# Altium schematic sheet ADS1299IPAG.SchDoc
size A3; SheetNumber: 4; SheetTotal: 9
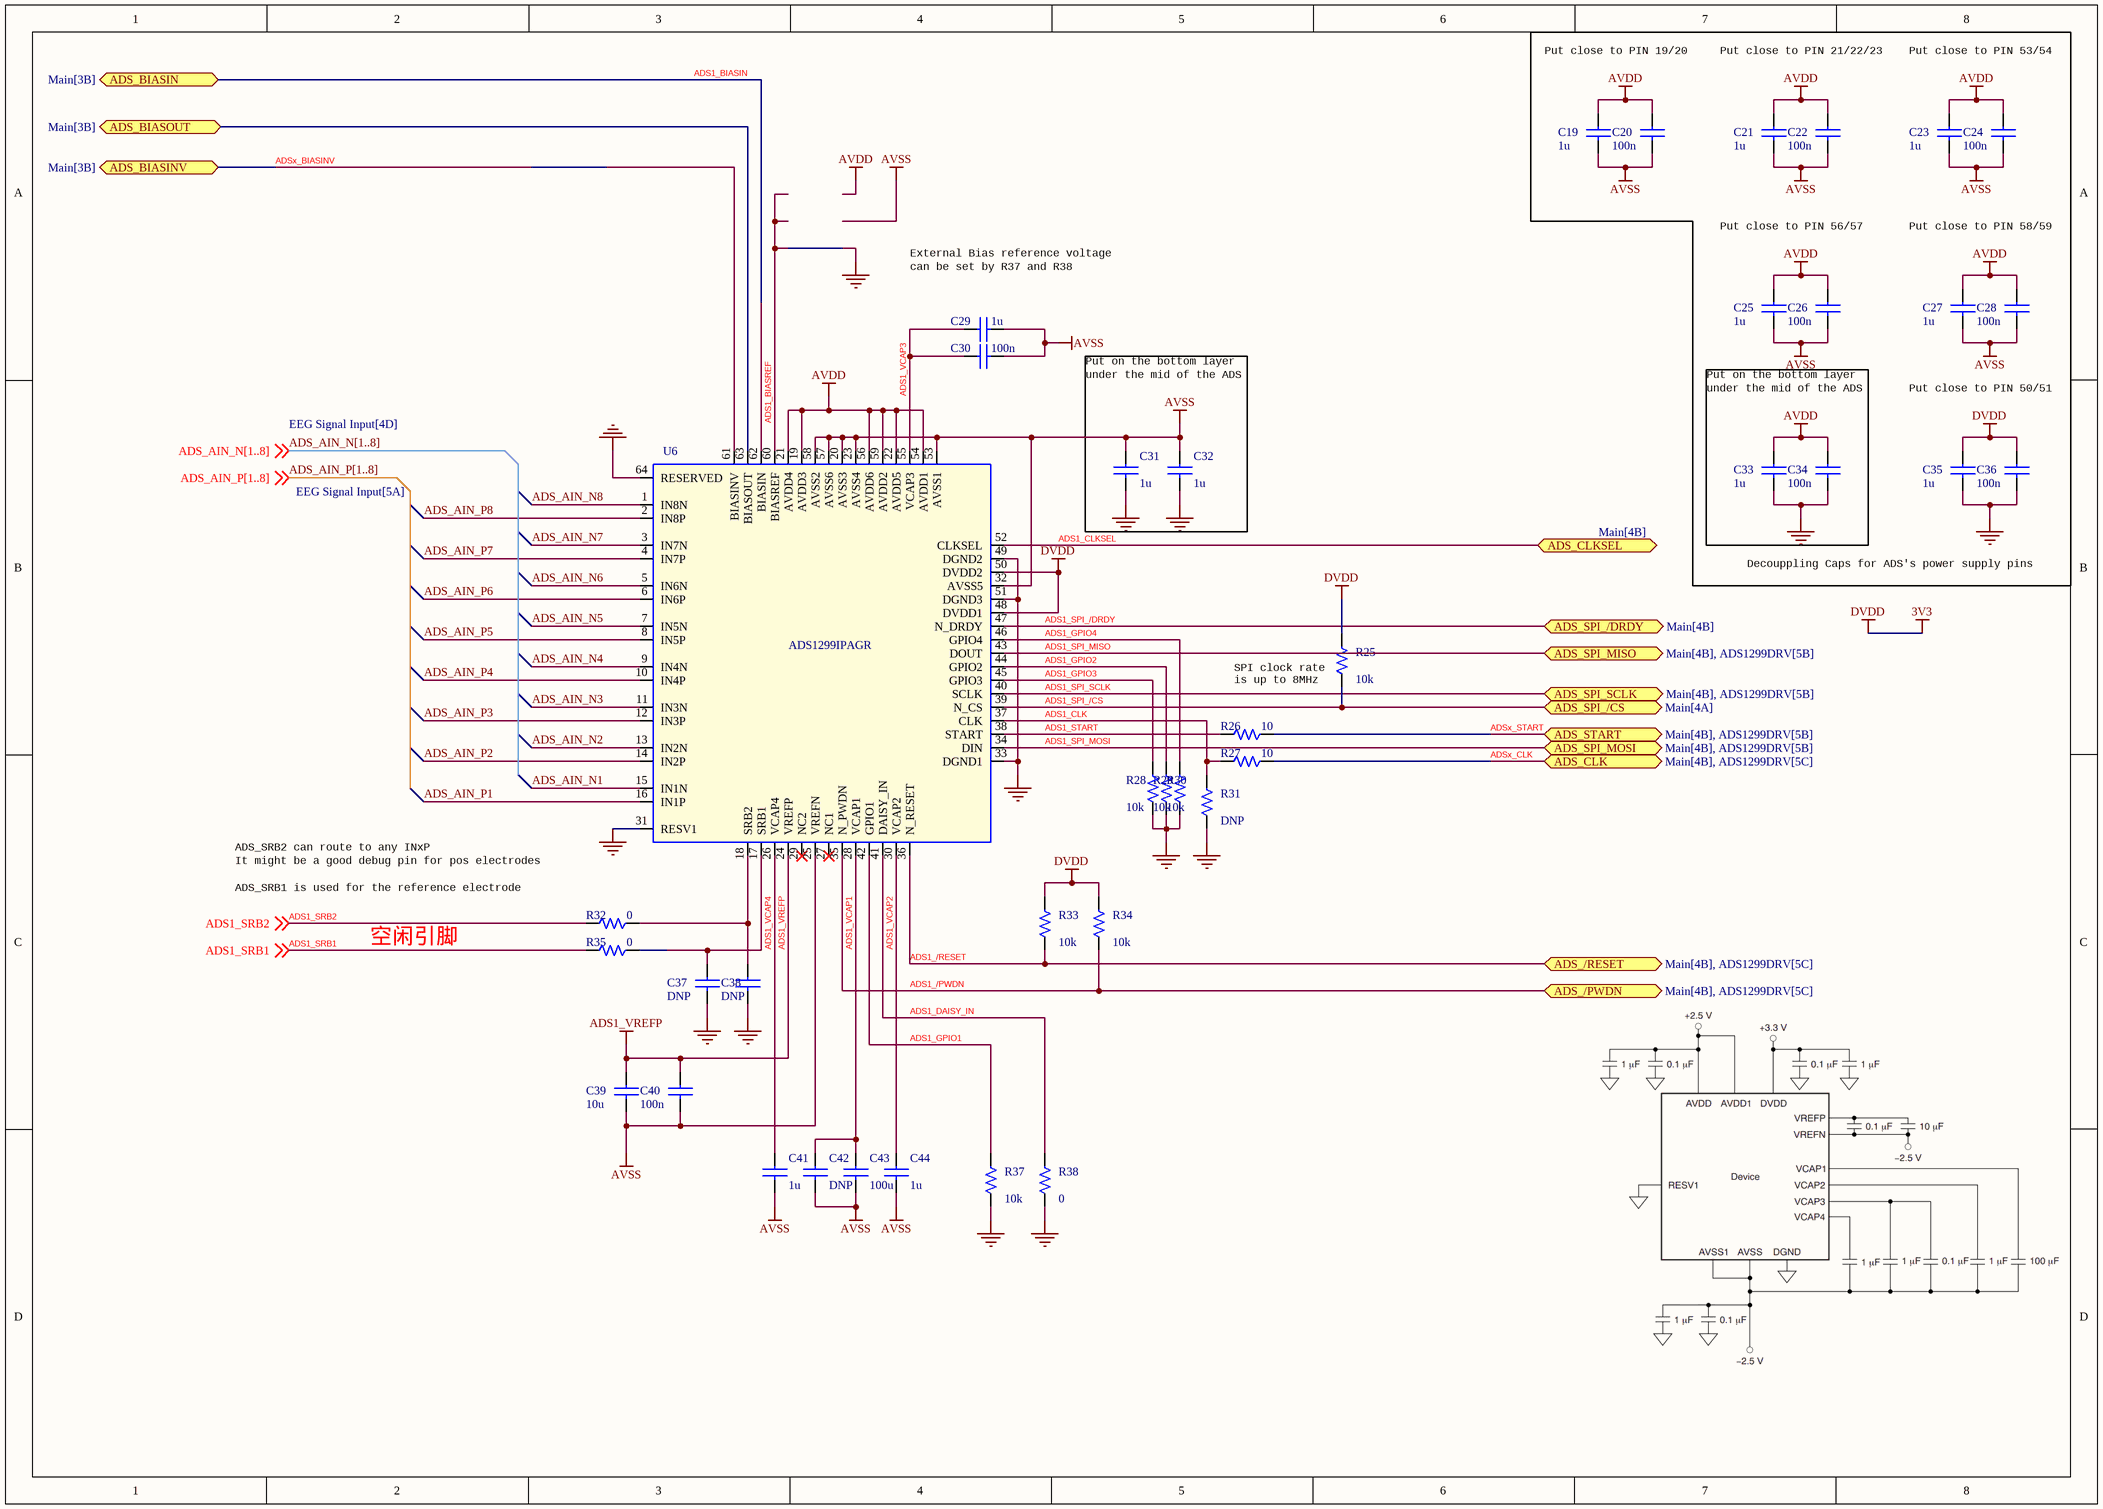
[diagram p0: ADS1299IPAG.SchDoc]

## Parts
C19  1u  [0201_C]
C20  100n  [0201_C]
C21  1u  [0201_C]
C22  100n  [0201_C]
C23  1u  [0201_C]
C24  100n  [0201_C]
C25  1u  [0201_C]
C26  100n  [0201_C]
C27  1u  [0201_C]
C28  100n  [0201_C]
C29  1u  [0201_C]
C30  100n  [0201_C]
C31  1u  [0201_C]
C32  1u  [0201_C]
C33  1u  [0201_C]
C34  100n  [0201_C]
C35  1u  [0201_C]
C36  100n  [0201_C]
C37  DNP  [0402_C]
C38  DNP  [0402_C]
C39  10u  [0402_C]
C40  100n  [0201_C]
C41  1u  [0201_C]
C42  DNP  [0201_C]
C43  100u  [0201_C]
C44  1u  [0201_C]
R25  10k  [0201_R]
R26  10  [0201_R]
R27  10  [0201_R]
R28  10k  [0201_R]
R29  10k  [0201_R]
R30  10k  [0201_R]
R31  DNP  [0201_R]
R32  0  [0402_R]
R33  10k  [0201_R]
R34  10k  [0201_R]
R35  0  [0402_R]
R37  10k  [0201_R]
R38  0  [0201_R]
U6  ADS1299IPAGR  [TQFP-64_L10.0-W10.0-P0.50-LS12.0-TL]

## Ports
ADS_/PWDN (bidir, see Main[4B], ADS1299DRV[5C]), ADS_/RESET (bidir, see Main[4B], ADS1299DRV[5C]), ADS_BIASIN (bidir, see Main[3B]), ADS_BIASINV (bidir, see Main[3B]), ADS_BIASOUT (bidir, see Main[3B]), ADS_CLK (bidir, see Main[4B], ADS1299DRV[5C]), ADS_CLKSEL (bidir, see Main[4B]), ADS_SPI_/CS (bidir, see Main[4A]), ADS_SPI_/DRDY (bidir, see Main[4B]), ADS_SPI_MISO (bidir, see Main[4B], ADS1299DRV[5B]), ADS_SPI_MOSI (bidir, see Main[4B], ADS1299DRV[5B]), ADS_SPI_SCLK (bidir, see Main[4B], ADS1299DRV[5B]), ADS_START (bidir, see Main[4B], ADS1299DRV[5B])

## Nets
3V3: C35.1 C36.1 R25.1 R33.1 R34.1 U6.48(DVDD1) U6.50(DVDD2)  [also labelled DVDD]
ADS1_BIASREF: C31.2 C32.2 C33.2 C34.2 C35.2 C36.2 C37.2 C38.2 R28.2 R29.2 R30.2 R31.2 R37.2 R38.2 U6.31(RESV1) U6.33(DGND1) U6.49(DGND2) U6.51(DGND3) U6.60(BIASREF) U6.64(RESERVED)  [also labelled GND]
ADS1_VREFP: C39.1 C40.1 U6.24(VREFP)
AVDD: C19.1 C20.1 C21.1 C22.1 C23.1 C24.1 C25.1 C26.1 C27.1 C28.1 C33.1 C34.1 U6.19(AVDD3) U6.21(AVDD4) U6.22(AVDD5) U6.54(AVDD1) U6.56(AVDD6) U6.59(AVDD2)
AVSS: C19.2 C20.2 C21.2 C22.2 C23.2 C24.2 C25.2 C26.2 C27.2 C28.2 C29.2 C30.2 C31.1 C32.1 C39.2 C40.2 C41.2 C42.2 C43.2 C44.2 U6.20(AVSS3) U6.23(AVSS4) U6.25(VREFN) U6.32(AVSS5) U6.53(AVSS1) U6.57(AVSS6) U6.58(AVSS2)
ADS1_/PWDN: R34.2 U6.35(N_PWDN) ; port ADS_/PWDN
ADS1_/RESET: R33.2 U6.36(N_RESET) ; port ADS_/RESET
ADS1_BIASIN: U6.62(BIASIN) ; port ADS_BIASIN
ADS1_CLK: R27.2 R31.1 U6.37(CLK)
ADS1_CLKSEL: U6.52(CLKSEL) ; port ADS_CLKSEL
ADS1_DAISY_IN: R38.1 U6.41(DAISY_IN)
ADS1_GPIO1: R37.1 U6.42(GPIO1)
ADS1_GPIO2: R29.1 U6.44(GPIO2)
ADS1_GPIO3: R28.1 U6.45(GPIO3)
ADS1_GPIO4: R30.1 U6.46(GPIO4)
ADS1_SPI_/CS: R25.2 U6.39(N_CS) ; port ADS_SPI_/CS
ADS1_SPI_/DRDY: U6.47(N_DRDY) ; port ADS_SPI_/DRDY
ADS1_SPI_MISO: U6.43(DOUT) ; port ADS_SPI_MISO
ADS1_SPI_MOSI: U6.34(DIN) ; port ADS_SPI_MOSI
ADS1_SPI_SCLK: U6.40(SCLK) ; port ADS_SPI_SCLK
ADS1_SRB1: R35.2 ; off-sheet ADS1_SRB1
ADS1_SRB2: R32.2 ; off-sheet ADS1_SRB2
ADS1_START: R26.2 U6.38(START)
ADS1_VCAP1: C42.1 C43.1 U6.28(VCAP1)
ADS1_VCAP2: C44.1 U6.30(VCAP2)
ADS1_VCAP3: C29.1 C30.1 U6.55(VCAP3)
ADS1_VCAP4: C41.1 U6.26(VCAP4)
ADS_AIN_N1: U6.15(IN1N)
ADS_AIN_N2: U6.13(IN2N)
ADS_AIN_N3: U6.11(IN3N)
ADS_AIN_N4: U6.9(IN4N)
ADS_AIN_N5: U6.7(IN5N)
ADS_AIN_N6: U6.5(IN6N)
ADS_AIN_N7: U6.3(IN7N)
ADS_AIN_N8: U6.1(IN8N)
ADS_AIN_P1: U6.16(IN1P)
ADS_AIN_P2: U6.14(IN2P)
ADS_AIN_P3: U6.12(IN3P)
ADS_AIN_P4: U6.10(IN4P)
ADS_AIN_P5: U6.8(IN5P)
ADS_AIN_P6: U6.6(IN6P)
ADS_AIN_P7: U6.4(IN7P)
ADS_AIN_P8: U6.2(IN8P)
ADS_BIASOUT: U6.63(BIASOUT) ; port ADS_BIASOUT
ADSx_BIASINV: U6.61(BIASINV) ; port ADS_BIASINV
ADSx_CLK: R27.1 ; port ADS_CLK
ADSx_START: R26.1 ; port ADS_START
NetC37_1: C37.1 R35.1 U6.17(SRB1)
NetC38_1: C38.1 R32.1 U6.18(SRB2)

Not connected (* = marked no-connect by the designer): U6 27(NC1)* 29(NC2)*

## Buses and harness runs
bus ADS_AIN_N[1..8]
bus ADS_AIN_P[1..8]

## Notes on the sheet
- Put close to PIN 19/20
- Put close to PIN 21/22/23
- Put close to PIN 53/54
- Put close to PIN 56/57
- Put close to PIN 58/59
- External Bias reference voltage
- can be set by R37 and R38
- Put on the bottom layer
- under the mid of the ADS
- Put close to PIN 50/51
- Decouppling Caps for ADS's power supply pins
- (near R25) SPI clock rate
  is up to 8MHz
- ADS_SRB2 can route to any INxP
- ADS_SRB1 is used for the reference electrode
- It might be a good debug pin for pos electrodes
- 空闲引脚

## Library data of the parts
C19 C21 C23 C25 C27 C29 C31-C33 C35 C41 C44 = CAP0402: CAP CER 1UF 25V X5R 0402; Part Number: CC0402KRX5R8BB105; Manufacturer: YAGEO; FPLIST: 0402_smd; PCB Footprint: C0402; Distributor: LCSC; Distributor Part Number: C326568; Distributor Link: https://item.szlcsc.com/306662.html; Manufacturer Part Number: CC0402KRX5R8BB105
C20 C22 C24 C26 C28 C30 C34 C36 C40 = CAP0402: CAP CER 0.1UF 25V X7R 0402; Part Number: CC0402KRX7R8BB104; Manufacturer: YAGEO; FPLIST: 0402_smd; PCB Footprint: C0402; Distributor: LCSC; Distributor Part Number: C105883; Distributor Link: https://item.szlcsc.com/107098.html; Manufacturer Part Number: CC0402KRX7R8BB104
C37 C38 C42 = CAP0402: FPLIST: 0402_smd; PCB Footprint: C0402
C39 = CAP0402: CAP CER 10UF 10V X5R 0603; Part Number: CL10A106KP8NNNC; Manufacturer: Samsung Electro-Mechanics; FPLIST: 0402_smd; PCB Footprint: C0603; Distributor: LCSC; Distributor Part Number: C19702; Distributor Link: https://item.szlcsc.com/20411.html; Manufacturer Part Number: CL10A106KP8NNNC
C43 = CAP0402: CAP CER 100UF 10V X5R 1206; Part Number: GRM31CR61A107ME05L; Manufacturer: Murata Electronics; FPLIST: 0402_smd; PCB Footprint: C1206; Distributor: LCSC; Distributor Part Number: C312983; Distributor Link: https://item.szlcsc.com/295691.html; Manufacturer Part Number: GRM31CR61A107ME05L
R25 R28-R30 R37 = RES: RES SMD 10K OHM 1% 1/16W 0402; Manufacturer: YAGEO; Manufacturer Part Number: RC0402FR-0710KL; PCB Footprint: R0402; Part Number: RC0402FR-0710KL; Distributor Part Number: C60490; Distributor: LCSC; Distributor Link: https://item.szlcsc.com/61542.html
R26 R27 = RES: RES SMD 10 OHM 1% 1/10W 0402; Manufacturer: YAGEO; Manufacturer Part Number: RC0402FR-0710RL; PCB Footprint: R0402; Part Number: RC0402FR-0710RL; Distributor Part Number: C138066; Distributor: LCSC; Distributor Link: https://item.szlcsc.com/149382.html
R31 = RES: PCB Footprint: R0402
R32 = RES: RES SMD 0 OHM JUMPER 1/16W 0402; Part Number: RC0402FR-070RL; Manufacturer: YAGEO; PCB Footprint: R0402; Distributor Link: https://item.szlcsc.com/107446.html; Distributor: LCSC; Distributor Part Number: C106231; Manufacturer Part Number: RC0402FR-070RL
R33 R34 = RES: RES SMD 10K OHM 1% 1/16W 0402; Part Number: RC0402FR-0710KL; Manufacturer: YAGEO; PCB Footprint: R0402; Distributor Link: https://item.szlcsc.com/61542.html; Distributor: LCSC; Distributor Part Number: C60490; Manufacturer Part Number: RC0402FR-0710KL
R35 R38 = RES: RES SMD 0 OHM JUMPER 1/16W 0402; Manufacturer: YAGEO; Manufacturer Part Number: RC0402FR-070RL; PCB Footprint: R0402; Part Number: RC0402FR-070RL; Distributor Part Number: C106231; Distributor: LCSC; Distributor Link: https://item.szlcsc.com/107446.html
U6 = ADS1299IPAGR: IC AFE 8 CHAN 24BIT 64TQFP; Manufacturer: Texas Instruments; PCB Footprint: ADS1299IPAGR_TQFP64; Distributor Link: https://www.digikey.cn/product-detail/zh/texas-instruments/ADS1299IPAGR/296-34818-1-ND/3536905?keywords=ADS1299IPAGR; Distributor: Digikey; Manufacturer Part Number: ADS1299IPAGR; Part Number: ADS1299IPAGR; Distributor Part Number: 296-34818-1-ND